# EasyEDA Pro project Potentiometers smd EasyEDA professional project.epro

# Schematic Schematic1
Create Date: 2025-01-08; Page Name: P1; Project Name: smd_pot_op_ap_mr_30_pw; Schematic Name: Schematic1; Update Date: 2025-01-09; Company: EasyEDA.com; Page Size: A4; Version: V1.0
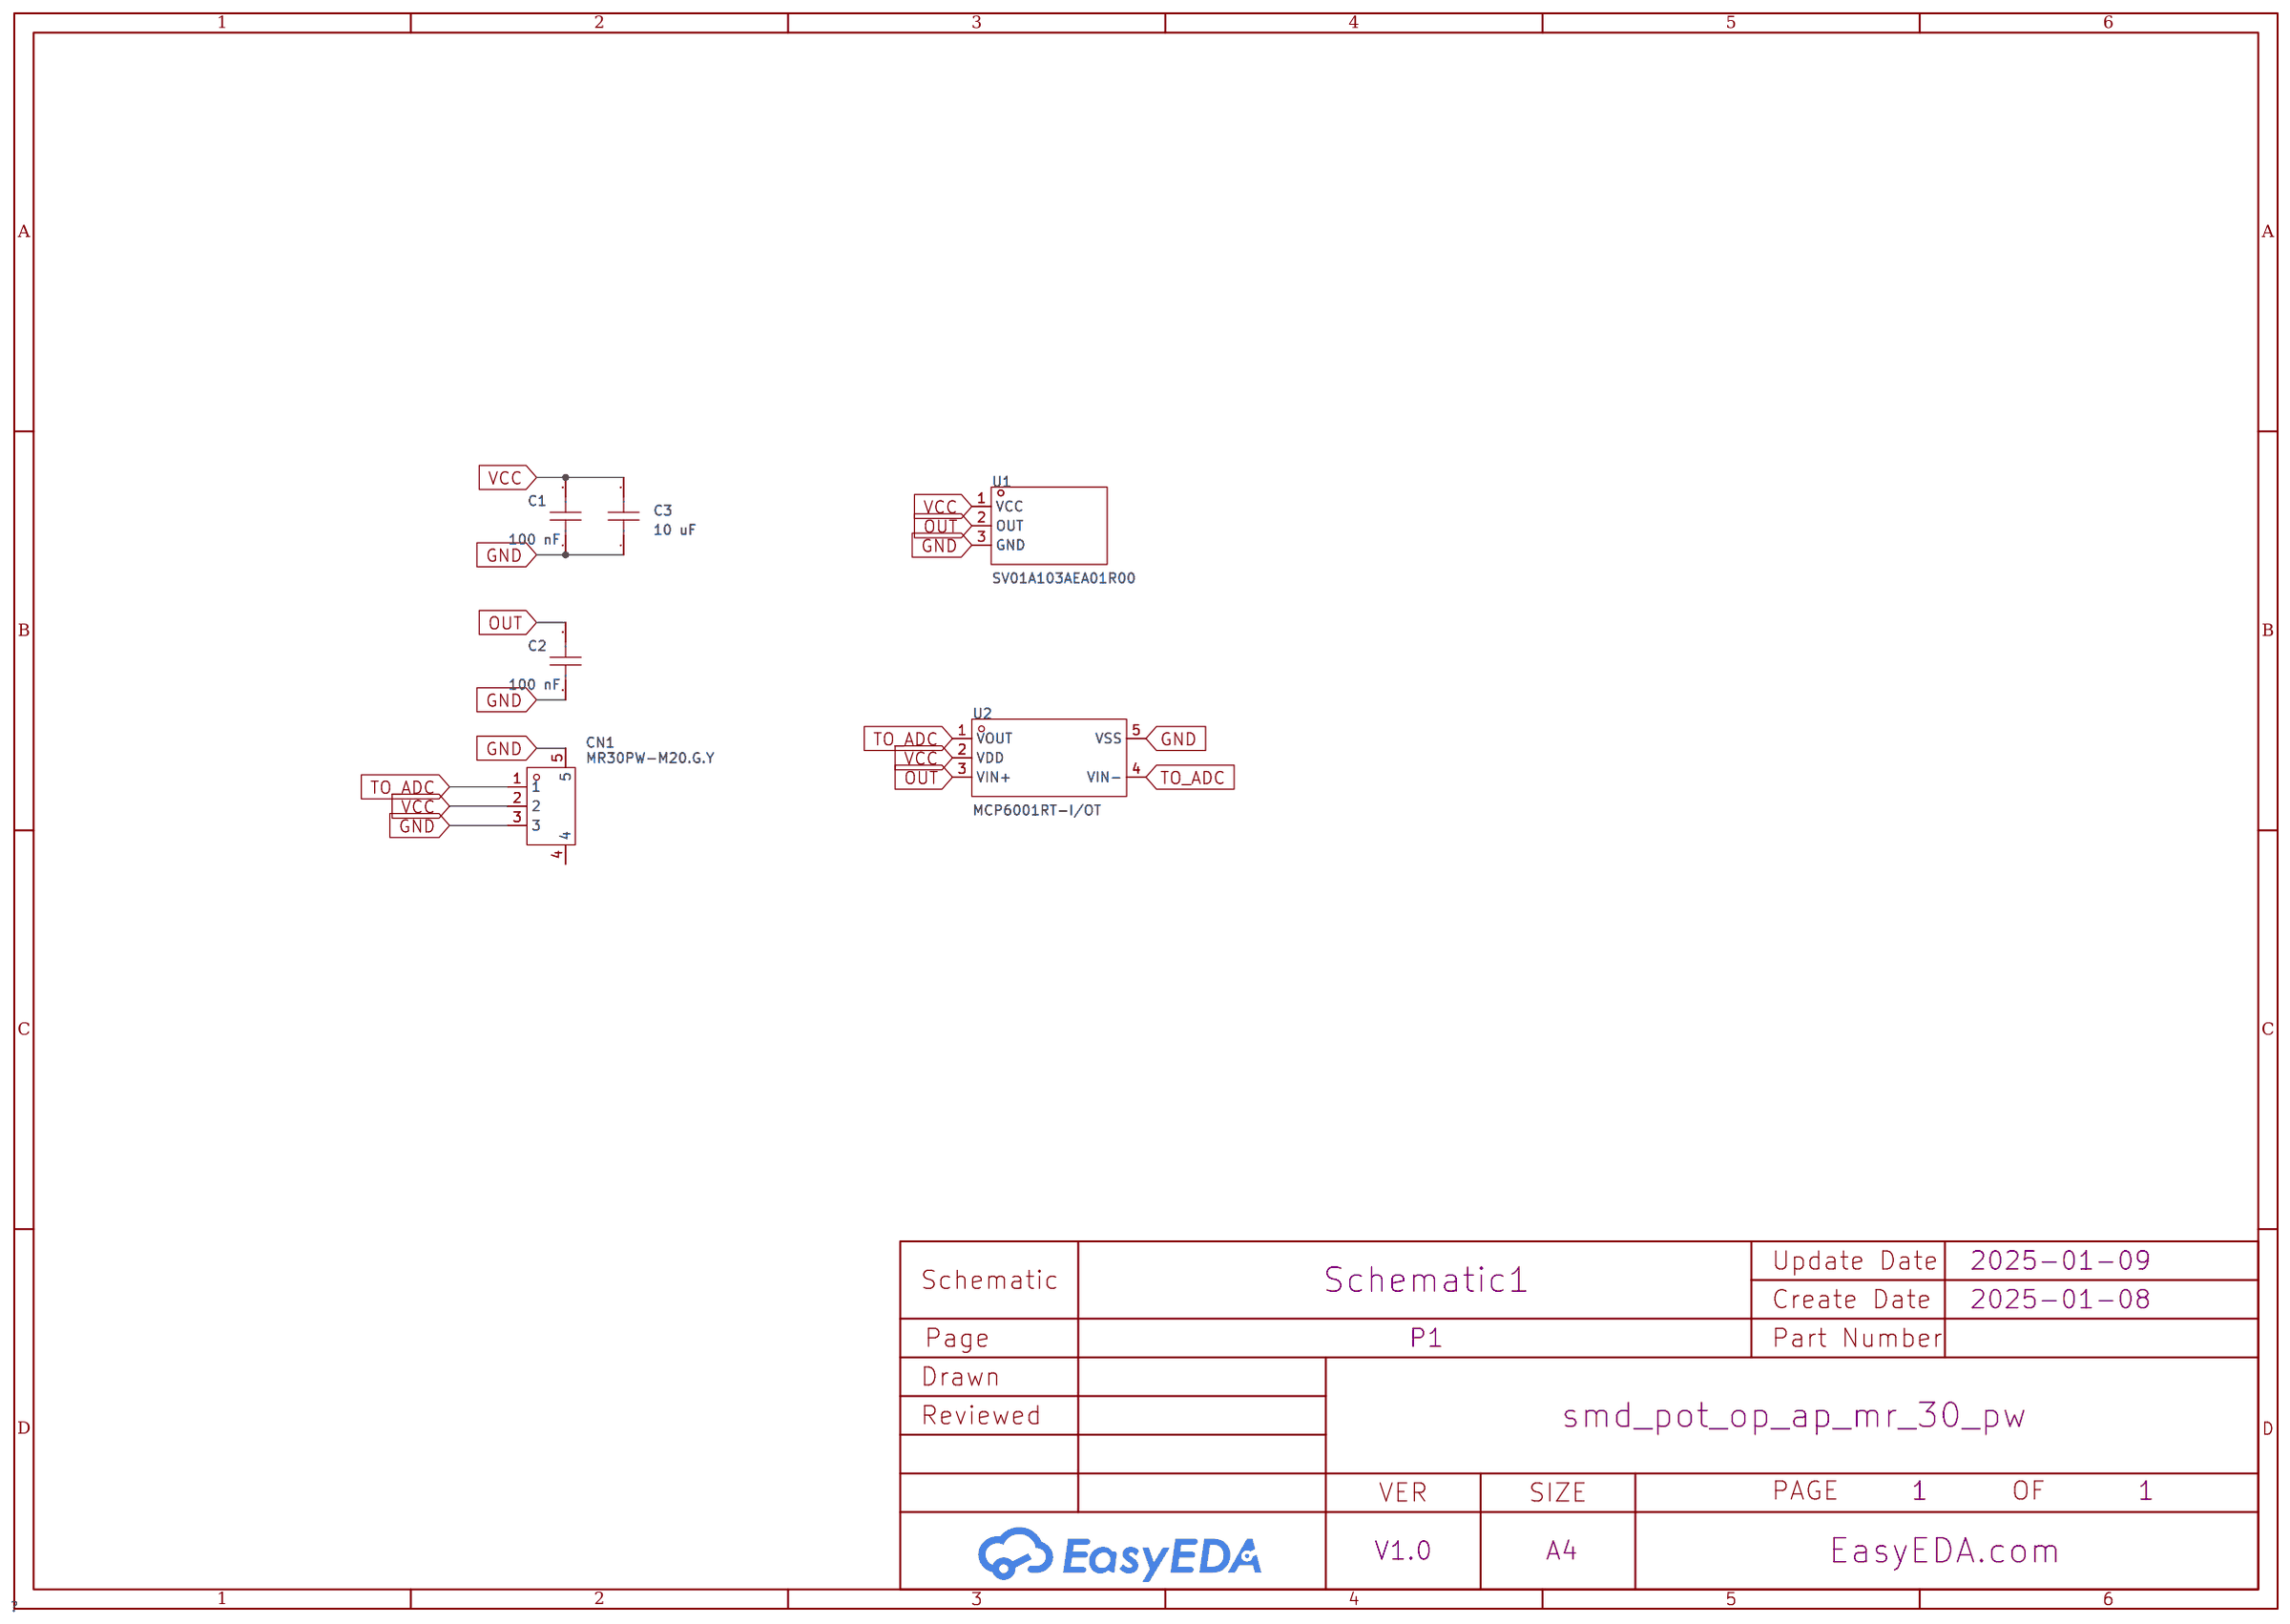
[diagram p0: schematic sheet]

## Parts
C1  100 nF  [C0603]
C2  100 nF  [C0603]
C3  10 uF  [C0603]
CN1  MR30PW-M20.G.Y  [CONN-TH_MR30PW-M30-G-Y]
U1  SV01A103AEA01R00  [SENSOR-SMD_SV01A103AEA01R00]
U2  MCP6001RT-I/OT  [SOT-23-5_L3.0-W1.7-P0.95-LS2.8-BR]

## Library data of the parts
C1-C3 = CAP_0603: Supplier Footprint: 0603
CN1 = MR30PW-M20.G.Y: LCSC Part Name: MR30PW20三芯PCB 弯插公金黄H=2mm; Supplier Part: C19268034; Manufacturer: AMASS(艾迈斯); JLCPCB Part Class: Extended Part; Datasheet: https://atta.szlcsc.com/upload/public/pdf/source/20231221/E63D24EDC016665263C6304FABBAAC61.pdf; Supplier: LCSC
U1 = SV01A103AEA01R00: Type:- Interface Type:- Supply Voltage:- Supply Voltage:- Rotation Angle:- Rotation Angle:- Iinearity Range:- Iinearity Range:- Supply Current:-; Supplier Part: C91659; Manufacturer: muRata(村田); Supplier Footprint: SMD-4P,11x12mm; JLCPCB Part Class: Extended Part; Datasheet: https://atta.szlcsc.com/upload/public/pdf/source/20161226/1482720184085.pdf; Supplier: LCSC
U2 = MCP6001RT-I/OT: Number of Circuits:Single channel Maximum Power Supply Range (Vdd-Vss):6V Rail to Rail:Rail-to-rail input, rail-to-rail output Gain Bandwidth Product(GBP):1MHz Voltage - Input Offset(Vos):4.5mV Input Offset Voltage Drift (Vos TC):2uV/℃ Slew Rate(SR):0.6V/; Supplier Part: C154973; Manufacturer: MICROCHIP(美国微芯); Supplier Footprint: SOT-23-5; JLCPCB Part Class: Extended Part; Datasheet: https://atta.szlcsc.com/upload/public/pdf/source/20180629/C185041_C55B4C85D5111611539E93F28BD05430.pdf; Supplier: LCSC; Number of Circuits: Single channel; Maximum Power Supply Range (Vdd-Vss): 6V; Rail to Rail: Rail-to-rail input, rail-to-rail output; Gain Bandwidth Product(GBP): 1MHz; Voltage - Input Offset(Vos): 4.5mV; Input Offset Voltage Drift (Vos TC): 2uV/℃; Slew Rate(SR): 0.6V/us; Current - Input Bias(Ib): 1pA; Noise density(eN): 28nV/√Hz@1kHz; Common Mode Rejection Ratio (CMRR): 76dB; Output Current: 23mA; Operating Temperature: -40℃~+85℃

## Nets
GND: C1.1 C2.1 C3.1 CN1.3 CN1.5 U1.3(GND) U2.5(VSS)
VCC: C1.2 C3.2 CN1.2 U1.1(VCC) U2.2(VDD)
OUT: C2.2 U1.2(OUT) U2.3(VIN+)
TO_ADC: CN1.1 U2.1(VOUT) U2.4(VIN-)

Not connected (* = marked no-connect by the designer): CN1 4

# Board PCB1
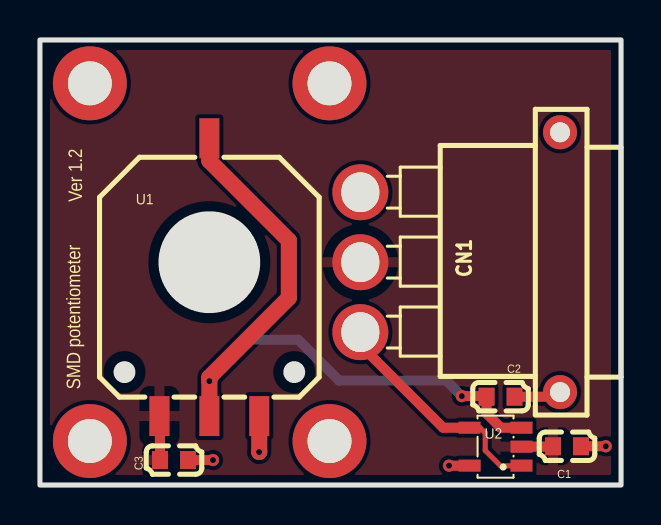
[diagram p1: board, top side]
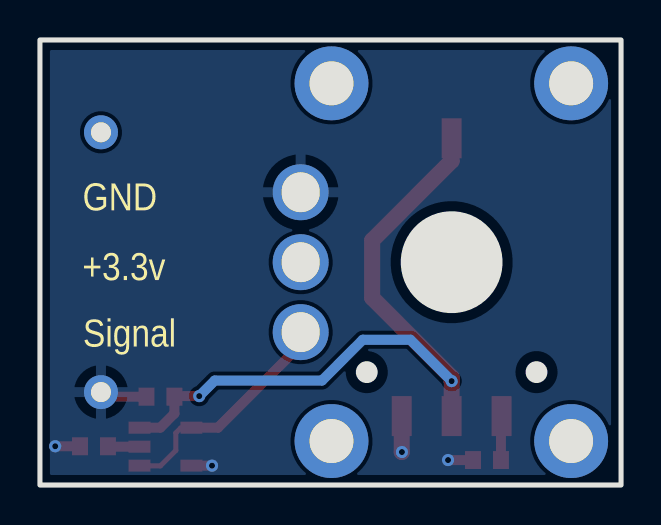
[diagram p2: board, bottom side, seen from below]

Outline 29.1 x 22.27 mm; copper layers: Top Layer, Bottom Layer. Coordinates in mm from the lower left corner of the outline.
Outline path: rectangle 0,22.27 29.1,0
Stack: Top Layer 0.035mm / Dielectric1 1.51mm FR4 er 4.5 / Bottom Layer 0.035mm

## Design rules (mm)
template: JLCPCB Capability(Two Layers Board)
spacing copperThickness1oz (default): track to track 0.102, other pairs 0.152 to 0.3
spacing copperThickness2oz: track to track 0.203, other pairs 0.152 to 0.3
track width copperThickness1oz (default): min 0.127, default 0.254, max 2.54
track width copperThickness2oz: min 0.203, default 0.254, max 2.54
differential pair differentialPair (default): width min 0.127, default 0.254, max 2.54; gap min 0.152, default 0.152
via viaSize (default): diameter min 0.5, default 0.61, max 10; hole min 0.3, default 0.305, max 6.3

## Placement (name value [footprint] x y rotation side)
C1  100 nF  [C0603]  26.39 1.94 180 top
C2  100 nF  [C0603]  23.06 4.42 180 top
C3  10 uF  [C0603]  6.71 1.25 180 top
CN1  MR30PW-M20.G.Y  [conn-th_mr30pw-m30-g-y]  21.04 11.15 90 top
NOREF  -  [Pad_e10]  2.5 2.2 0 top
NOREF#2  -  [Pad_e65]  14.5 20.1 0 top
NOREF#3  -  [Pad_e9]  2.5 20.1 0 top
NOREF#4  -  [Pad_e64]  14.5 2.2 0 top
U1  SV01A103AEA01R00  [SENSOR-SMD_SV01A103AEA01R00]  8.48 10.4 0 top
U2  MCP6001RT-I/OT  [SOT-23-5_L3.0-W1.7-P0.95-LS2.8-BR]  22.81 1.92 0 top

## Footprints (pads in the part's own frame, mm; a bottom-side part is the same pattern mirrored in y, then rotated)
C0603
  rect 0.8x0.9 smd: 1(-0.7,0) 2(0.7,0)
conn-th_mr30pw-m30-g-y
  round 2.8 hole 1.995x1.9: 1(-3.5,5) 2(0,5) 3(3.5,5)
  round 1.7 hole 1: 4(6.5,-5) 5(-6.5,-5)
Pad_e9
  round 3.7 hole 2.2: 4(0,0)
Pad_e10
  round 3.7 hole 2.2: 4(0,0)
Pad_e64
  round 3.7 hole 2.2: 4(0,0)
Pad_e65
  round 3.7 hole 2.2: 4(0,0)
SENSOR-SMD_SV01A103AEA01R00
  rect 1x2 smd: 1(-2.5,-6.95) 2(0,6.95) 2(0,-6.95) 3(2.5,-6.95)
SOT-23-5_L3.0-W1.7-P0.95-LS2.8-BR
  rect 1.1x0.6 smd: 1(1.3,-0.95) 2(1.3,0) 3(1.3,0.95) 4(-1.3,0.95) 5(-1.3,-0.95)

## Nets
As in the schematic.

Pads without a net: CN1 4; NOREF 4; NOREF#2 4; NOREF#3 4; NOREF#4 4

## Via types
v1: diameter 0.61, hole 0.305, Top Layer to Bottom Layer, 6 vias

## Routing (per net, layer and track width the routed paths; a pad name or vN(x,y) marks a point on that pad's centre or on a via; arc(x,y) is an arc through that point)
GND: length 7.7
  Top Layer w0.5: CN1.5 25.81,4.42 C2.1 ; v1(8.66,1.25) C3.1 ; v1(28.34,1.94) C1.1 ; v1(20.48,0.97) U2.5
  Top Layer w0.8: U1.3 10.98,1.66 v1(10.97,1.65)
VCC: length 3.8
  Top Layer w0.5: C1.2 25.67,1.92 U2.2 ; C3.2 6.01,3.42 U1.1
OUT: length 36
  Top Layer w0.5: U2.3 23.07,2.87 22.36,3.58 C2.2 22.33,4.45 v1(21.12,4.45)
  Top Layer w0.8: U1.2 8.48,16.22 12.46,12.24 12.46,9.37 8.48,5.39 v1(8.48,5.2) U1.2
  Bottom Layer w0.5: v1(21.12,4.45) 20.34,5.23 14.97,5.23 12.93,7.27 10.55,7.27 v1(8.48,5.2)
TO_ADC: length 11.7
  Top Layer w0.254: 24.14,0.96 23.07,0.96 22.3,1.73 22.3,2.61 22.04,2.86 21.54,2.86
  Top Layer w0.5: U2.4 20.18,2.87 16.04,7.01 CN1.1

## Copper pours and planes (outline as drawn; the poured copper is in the pictures)
GND on Bottom Layer: 0.02,22.36 30.42,22.36 30.42,0.19 0.02,0.19
VCC on Top Layer: 0.02,22.27 30.02,22.27 30.02,0.03 0.02,0.03

## Text on the board
Bottom Silkscreen Layer: Signal | GND | +3.3v
Top Silkscreen Layer: SMD potentiometer | Ver 1.2
